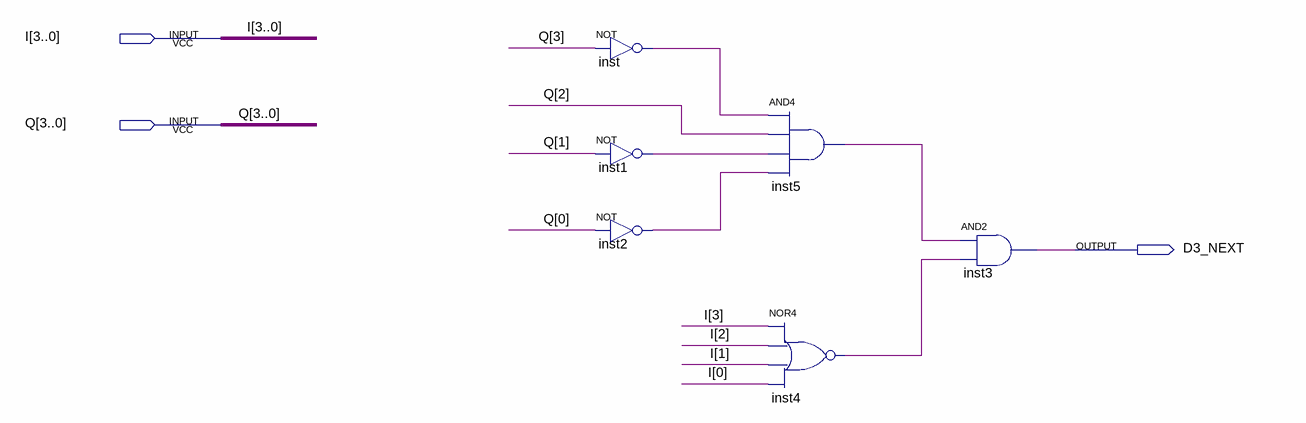
[diagram p0: schematic sheet]
// Quartus schematic D3_GEN.bdf as structural Verilog: 6 symbols, 3 pins
module D3_GEN (
  input  [3:0] I,
  input  [3:0] Q,
  output D3_NEXT
);

  wire inst1_out, inst2_out, inst4_out, inst5_out, inst_out;

  not inst (inst_out, Q[3]);
  not inst1 (inst1_out, Q[1]);
  not inst2 (inst2_out, Q[0]);
  and inst5 (inst5_out, inst_out, Q[2], inst1_out, inst2_out);
  nor inst4 (inst4_out, I[3], I[2], I[1], I[0]);
  and inst3 (D3_NEXT, inst5_out, inst4_out);
endmodule
